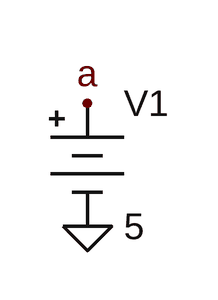
[diagram p0: schematic library_folder_named.asc]
library_folder_named.asc, the LTspice schematic file:
Version 4
SHEET 1 880 680
FLAG 96 112 a
FLAG 96 192 0
SYMBOL Misc\\battery 96 96 R0
SYMATTR InstName V1
SYMATTR Value 5

The netlist it stands for:
* library_folder_named.asc
V1 a 0 5
.backanno
.end